# EAGLE design LaunchpadGroveBaseboard (EAGLE 6.1)
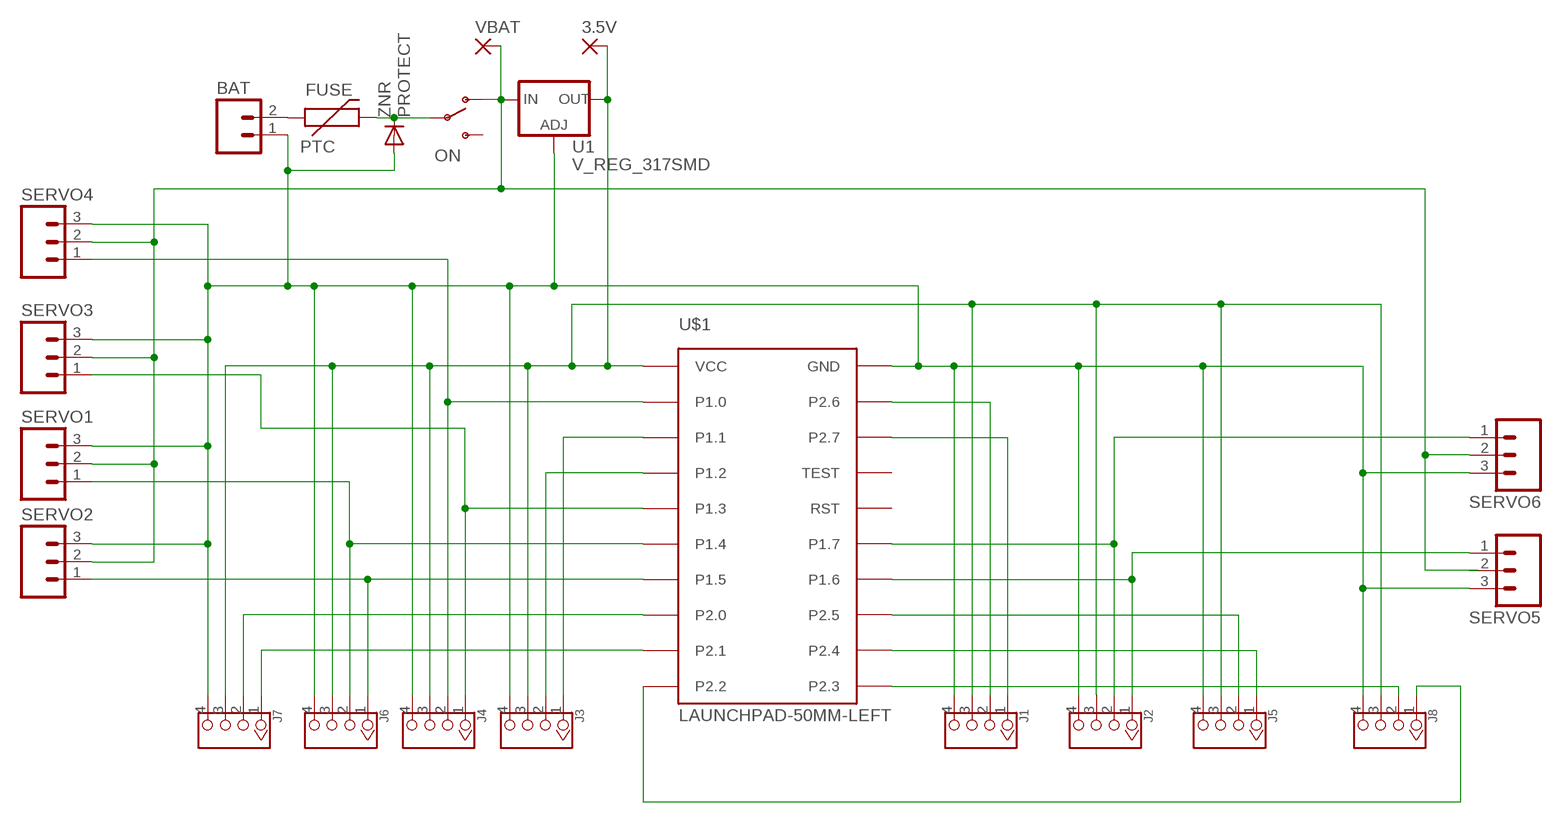
[diagram p0: schematic, sheet 1]

## Parts
3.5V  2,15/1,0  [2,15/1,0]
BAT  M02PTH  [1X02]
FUSE  PTC  PTCPTH  [PTC]
J1  TWIG-4P-2.0-2.0  [4P-2.0]
J2  TWIG-4P-2.0-2.0  [4P-2.0]
J3  TWIG-4P-2.0-2.0  [4P-2.0]
J4  TWIG-4P-2.0-2.0  [4P-2.0]
J5  TWIG-4P-2.0-2.0  [4P-2.0]
J6  TWIG-4P-2.0-2.0  [4P-2.0]
J7  TWIG-4P-2.0-2.0  [4P-2.0]
J8  TWIG-4P-2.0-2.0  [4P-2.0]
ON  SWITCH-SPSTPTH  [SWITCH-SPDT]
SERVO1  M03PTH  [1X03]
SERVO2  M03PTH  [1X03]
SERVO3  M03PTH  [1X03]
SERVO4  M03PTH  [1X03]
SERVO5  M03PTH  [1X03]
SERVO6  M03PTH  [1X03]
U1  V_REG_317SMD  [SOT223]
U$1  LAUNCHPAD-50MM-LEFT  [LAUNCHPAD-50MM-LEFT]
VBAT  2,15/1,0  [2,15/1,0]
ZNR  PROTECT  1N4004  [DO41-10]

## Nets
GND: BAT.1 J1.4 J2.4 J3.4 J4.4 J5.4 J6.4 J7.4 J8.4 SERVO1.3 SERVO2.3 SERVO3.3 SERVO4.3 SERVO5.3 SERVO6.3 U1.1(ADJ) U$1.GND ZNR.A
N$1: J3.2 U$1.P1.2
N$2: BAT.2 FUSE.P$1
N$3: J4.2 SERVO4.1 U$1.P1.0
N$4: J3.1 U$1.P1.1
N$6: J4.1 SERVO3.1 U$1.P1.3
N$7: J6.2 SERVO1.1 U$1.P1.4
N$8: J6.1 SERVO2.1 U$1.P1.5
N$9: J1.2 U$1.P2.6
N$10: J1.1 U$1.P2.7
N$11: J2.2 SERVO6.1 U$1.P1.7
N$12: J2.1 SERVO5.1 U$1.P1.6
N$13: J5.2 U$1.P2.5
N$14: J5.1 U$1.P2.4
N$15: J7.2 U$1.P2.0
N$16: FUSE.P$2 ON.2(P) ZNR.C
N$17: J8.1 U$1.P2.2
N$18: J8.2 U$1.P2.3
N$19: J7.1 U$1.P2.1
VBAT: ON.1(O) SERVO1.2 SERVO2.2 SERVO3.2 SERVO4.2 SERVO6.2 U1.3(IN) VBAT.1(P)
VCC: 3.5V.1(P) J1.3 J2.3 J3.3 J4.3 J5.3 J6.3 J7.3 J8.3 U1.2(OUT) U$1.VCC
Unconnected: ON.3(S) SERVO5.2 U$1.RST U$1.TEST

## Library data of the parts
3.5V VBAT = wirepad:2,15/1,0: THROUGH-HOLE PAD
BAT = SparkFun:M02: Header 2 Standard 2-pin 0.1" header. Use with straight break away headers (SKU : PRT-00116), right angle break away headers (PRT-00553), swiss pins (PRT-00743), machine pins (PRT-00117), and female headers (PRT-00115). Molex polarized connector foot print use with SKU : PRT-08233 with associated crimp pins and housings.
FUSE = SparkFun:PTC: Resettable Fuse PTC Resettable Fuse. Spark Fun Electronics SKU : COM-08357
J1-J8 = Connector:TWIG-4P-2.0
ON = SparkFun:SWITCH-SPST: SPST Switch Simple slide switch. Spark Fun Electronics SKU : COM-00102
SERVO1-SERVO6 = SparkFun:M03: Header 3 Standard 3-pin 0.1" header. Use with straight break away headers (SKU : PRT-00116), right angle break away headers (PRT-00553), swiss pins (PRT-00743), machine pins (PRT-00117), and female headers (PRT-00115). Molex polarized connector foot print use with SKU : PRT-08232 with associated crimp pins and housings.
U1 = SparkFun:V_REG_317: Voltage Regulator Standard LM317 adjustable voltage regulator. AOI (Adjust Output Input). Google 'LM317 Calculator' for easy to use app to get the two resistor values needed. 240/720 for 5V output. 240/390 for 3.3V output. Spark Fun Electronics SKU : COM-00527
U$1 = TI_launchpad:LAUNCHPAD: MSP-EXP430G2 LaunchPad Booster Pack layouts. LAUNCHPAD: Full-size board LAUNCHPAD-50MM: 50x50mm board covering the button area LAUNCHPAD-50MM-LEFT: 50x50mm board leaving the button area open. Tall LaunchPad components marked on Reference for reference.
ZNR = diode:1N4004: DIODE general purpose rectifier, 1 A

## Board
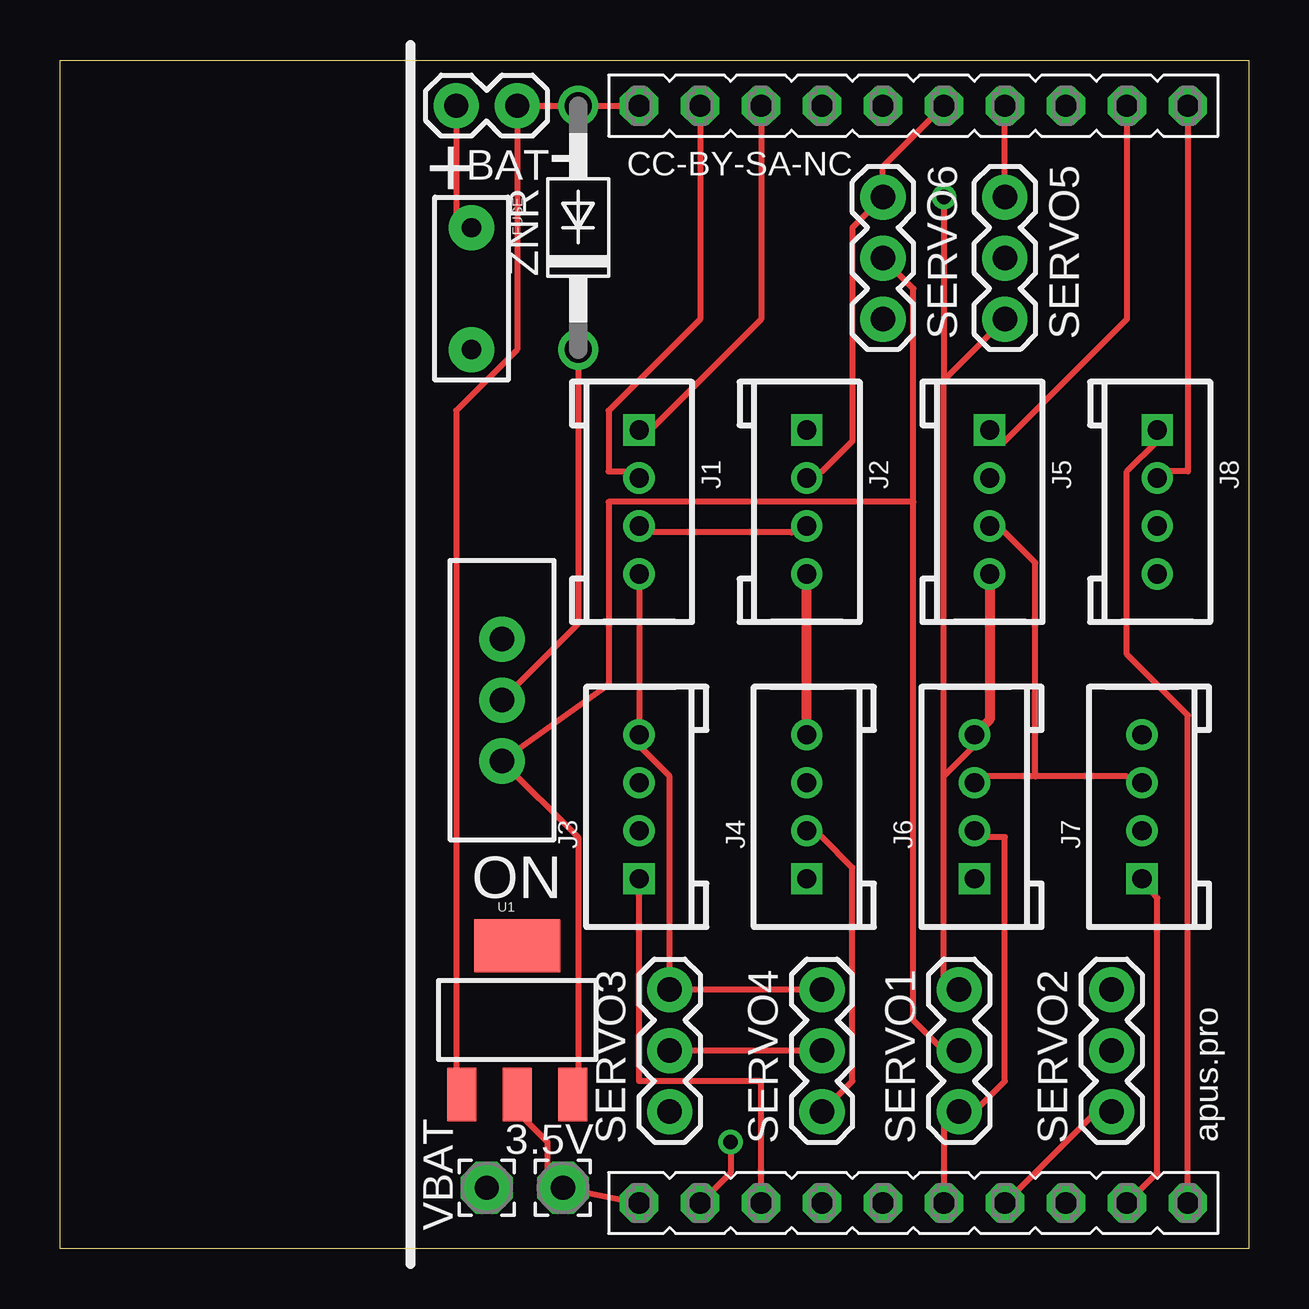
[diagram p1: board, top side]
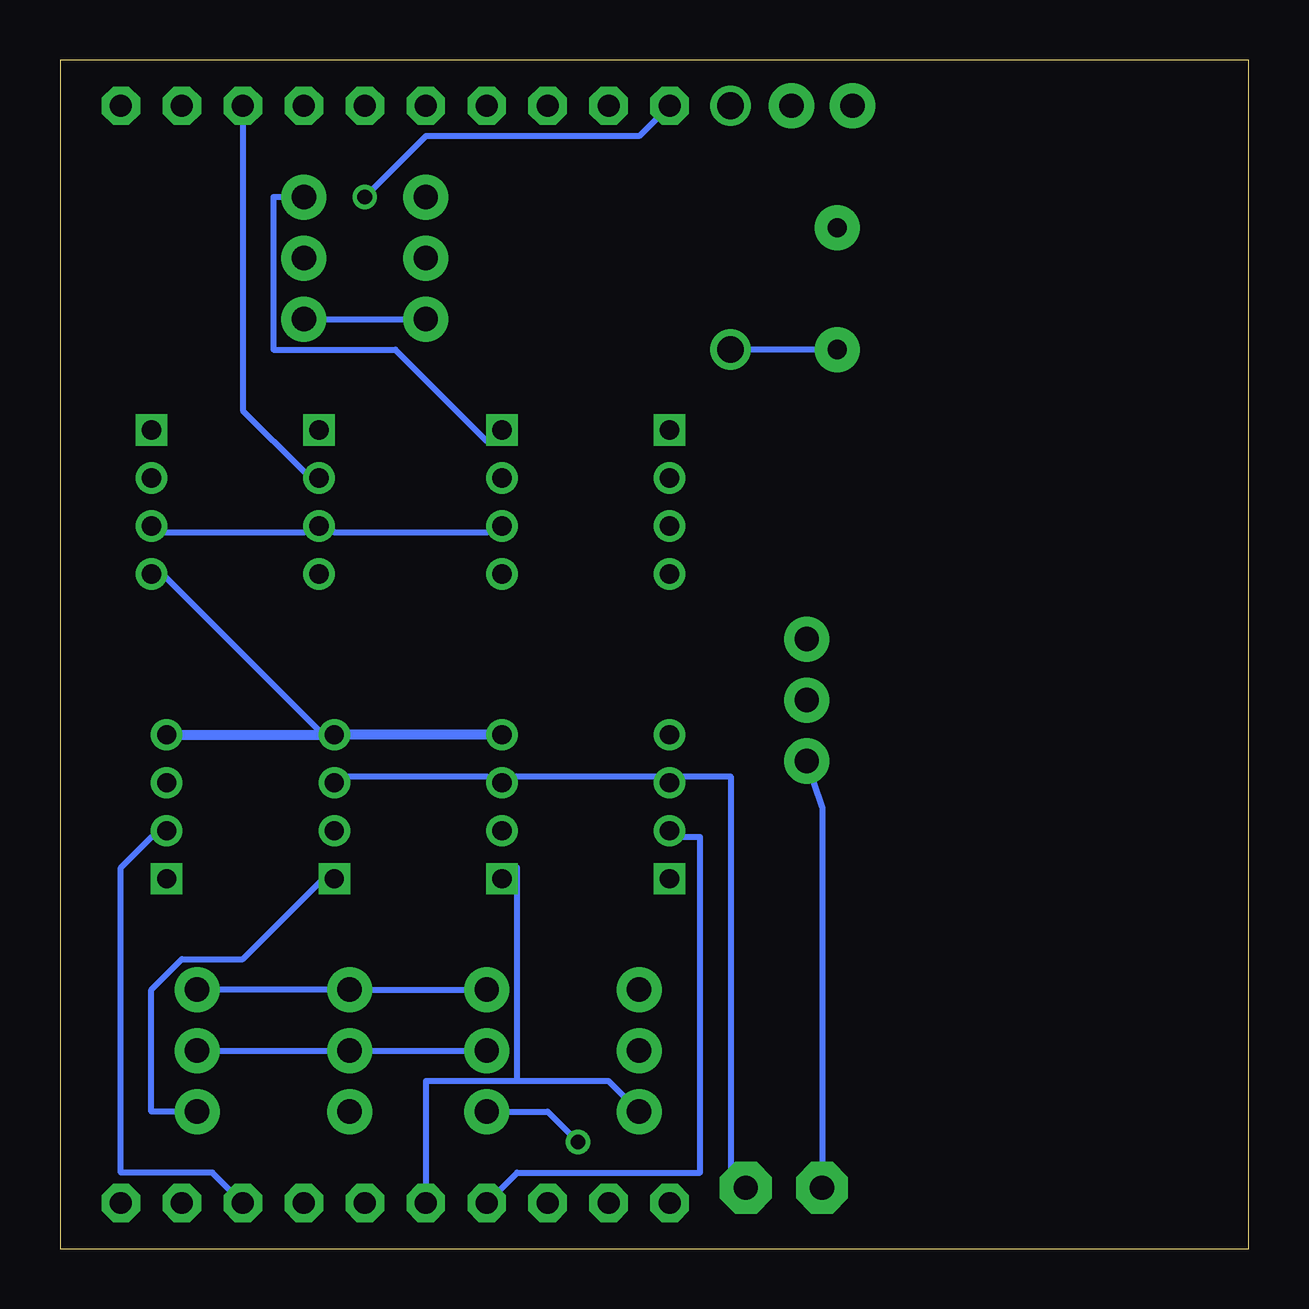
[diagram p2: board, bottom side, seen from below]

Size 49.53 x 49.53 mm. Coordinates in mm from the lower left corner, seen from the top.
Copper layers (1*16): Top 0.035mm / dielectric 1.5mm / Bottom 0.035mm
Design rules: minimum track width 10mil, minimum drill 24mil, track to track 8mil, track to pad 8mil, pad to pad 8mil, via to via 8mil, smd to smd 8mil, copper to edge 40mil, drill to drill 8mil, minimum pad ring 10mil, minimum via ring 8mil, stop-mask expansion 4mil, vias tented up to drill 0mil, thermal gap 10mil

### Footprints (pad centres in the part's own frame; a part is rotated, then mirrored left to right if it is on the bottom)
2,15/1,0 = drill 1.016 pad 2.159 octagon: 1 0,0
1X02 = drill 1.016 pad 1.88: 1 0,0; 2 2.54,0
PTC = drill 0.8 pad 1.88: P$1 -2.54,0; P$2 2.54,0
4P-2.0 = drill 0.8 pad 1.27 square: 1 -3,0 | drill 0.8 pad 1.27: 2 -1,0; 3 1,0; 4 3,0
SWITCH-SPDT = drill 1.016 pad 1.88: 1 0,2.54; 2 0,0; 3 0,-2.54
1X03 = drill 1.016 pad 1.88: 1 0,0; 2 2.54,0; 3 5.08,0
SOT223 = smd 1.219 x 2.235: 1 -2.311,-3.099; 2 0,-3.099; 3 2.311,-3.099 | smd 3.6 x 2.2: 4 0,3.099
LAUNCHPAD-50MM-LEFT = drill 0.914 pad 1.6 octagon: GND 24.13,48.26; P1.0 26.67,2.54; P1.1 29.21,2.54; P1.2 31.75,2.54; P1.3 34.29,2.54; P1.4 36.83,2.54; P1.5 39.37,2.54; P1.6 39.37,48.26; P1.7 36.83,48.26; P2.0 41.91,2.54; P2.1 44.45,2.54; P2.2 46.99,2.54; P2.3 46.99,48.26; P2.4 44.45,48.26; P2.5 41.91,48.26; P2.6 26.67,48.26; P2.7 29.21,48.26; RST 34.29,48.26; TEST 31.75,48.26; VCC 24.13,2.54
DO41-10 = drill 1.118: A 5.08,0; C -5.08,0

### Placement (x,y rotation side)
3.5V  20.96,2.54 0 top
BAT  19.05,47.62 180 top
FUSE  17.14,40 270 top
J1  24.13,31.12 270 top
J2  31.12,31.12 270 top
J3  24.13,18.41 90 top
J4  31.12,18.41 90 top
J5  38.73,31.12 270 top
J6  38.1,18.41 90 top
J7  45.09,18.41 90 top
J8  45.72,31.12 270 top
ON  18.41,22.86 180 top
SERVO1  37.47,5.71 90 top
SERVO2  43.81,5.71 90 top
SERVO3  25.4,5.71 90 top
SERVO4  31.75,5.71 90 top
SERVO5  39.37,43.81 270 top
SERVO6  34.29,43.81 270 top
U1  19.05,9.53 0 top
U$1  0,-0.64 0 top
VBAT  17.78,2.54 90 top
ZNR  21.59,42.55 90 top

### Tracks (layer width: path | path; a pad name or v marks a point on that pad's centre or on a via)
GND  (via drill 0.61)
  Top 0.254: 24.13,28.57 J1.4 J3.4 24.13,20.95 25.4,19.68 SERVO3.3 SERVO4.3 | 36.83,19.68 38.1,20.95 J6.4 | 36.83,19.68 36.83,10.79 SERVO1.3 | 36.83,36.2 SERVO5.3 | 36.83,19.68 36.83,36.2 | U$1.GND ZNR.A BAT.1 19.05,37.46 16.51,34.92 16.51,6.99 U1.1 | v36.83,43.81 36.83,36.2
  Top 0.406: J4.4 J2.4 | J5.4 38.73,22.05 J6.4
  Bottom 0.254: J8.4 45.72,28.57 38.1,20.95 J6.4 | SERVO2.3 SERVO1.3 SERVO4.3 | SERVO5.3 SERVO6.3 | v36.83,43.81 34.29,46.35 25.4,46.35 U$1.GND
  Bottom 0.406: J7.4 J6.4 J4.4
N$1
  Bottom 0.254: U$1.P1.2 30.48,3.17 22.86,3.17 22.86,17.14 24.13,17.14 J3.2
N$2
  Top 0.254: BAT.2 16.51,42.55 FUSE.P$1
N$3  (via drill 0.61)
  Top 0.254: SERVO4.1 33.02,6.99 33.02,15.88 31.75,17.14 J4.2 | U$1.P1.0 27.94,3.17 v27.94,4.44
  Bottom 0.254: v27.94,4.44 29.21,5.71 SERVO4.1
N$4
  Top 0.254: U$1.P1.1 29.21,6.99 24.13,6.99 J3.1 24.13,15.88
N$6
  Bottom 0.254: 30.48,6.99 30.48,15.88 J4.1 | 30.48,6.99 26.67,6.99 SERVO3.1 | U$1.P1.3 34.29,6.99 30.48,6.99
N$7
  Top 0.254: J6.2 38.1,17.14 39.37,17.14 39.37,6.99 38.1,5.71 SERVO1.1 36.83,5.71 U$1.P1.4
N$8
  Top 0.254: U$1.P1.5 43.18,5.71 SERVO2.1
  Bottom 0.254: SERVO2.1 45.72,5.71 45.72,10.79 44.45,12.07 41.91,12.07 38.1,15.88 J6.1
N$9
  Top 0.254: U$1.P2.6 26.67,38.73 22.86,34.92 22.86,32.38 24.13,32.38 J1.2
N$10
  Top 0.254: U$1.P2.7 29.21,38.73 24.13,33.66 J1.1
N$11
  Top 0.254: J2.2 31.75,32.38 33.02,33.66 33.02,42.55 SERVO6.1 34.29,45.09 U$1.P1.7
N$12
  Top 0.254: SERVO5.1 U$1.P1.6
  Bottom 0.254: SERVO5.1 40.64,43.81 40.64,37.46 35.56,37.46 31.75,33.66 J2.1
N$13
  Bottom 0.254: U$1.P2.5 41.91,34.92 39.37,32.38 J5.2
N$14
  Top 0.254: U$1.P2.4 44.45,38.73 39.37,33.66 J5.1
N$15
  Bottom 0.254: U$1.P2.0 43.18,3.17 46.99,3.17 46.99,15.88 45.72,17.14 J7.2
N$16
  Top 0.254: ON.2 21.59,26.04 ZNR.C
  Bottom 0.254: FUSE.P$2 ZNR.C
N$17
  Top 0.254: U$1.P2.2 46.99,22.22 44.45,24.77 44.45,32.38 45.72,33.66 J8.1
N$18
  Top 0.254: U$1.P2.3 46.99,32.38 45.72,32.38 J8.2
N$19
  Top 0.254: U$1.P2.1 45.72,3.17 45.72,14.61 J7.1
VBAT
  Top 0.254: U1.3 21.59,6.99 21.59,17.14 ON.1 22.86,23.49 22.86,31.12 35.56,31.12 | SERVO4.2 SERVO3.2 | SERVO6.2 35.56,40 35.56,31.12 | 35.56,31.12 35.56,9.53 36.83,8.26 SERVO1.2
  Bottom 0.254: VBAT.1 17.78,18.41 ON.1 | SERVO2.2 SERVO1.2 SERVO4.2
VCC
  Top 0.254: J1.3 24.13,29.84 30.48,29.84 J2.3 | U1.2 19.05,5.71 20.32,4.44 20.32,1.91 3.5V.1 U$1.VCC | 40.64,19.68 44.45,19.68 J7.3 | 40.64,19.68 38.1,19.68 J6.3 | 40.64,19.68 40.64,28.57 39.37,29.84 J5.3
  Bottom 0.254: J8.3 45.72,29.84 39.37,29.84 J5.3 38.1,29.84 31.75,29.84 J2.3 | 24.13,19.68 30.48,19.68 J4.3 31.75,19.68 38.1,19.68 J6.3 | 24.13,19.68 21.59,19.68 21.59,1.91 3.5V.1 | 24.13,19.68 J3.3

### Text on the board
tPlace: CC-BY-SA-NC | + | - | apus.pro